# EAGLE design decoder (EAGLE 7.2.0)
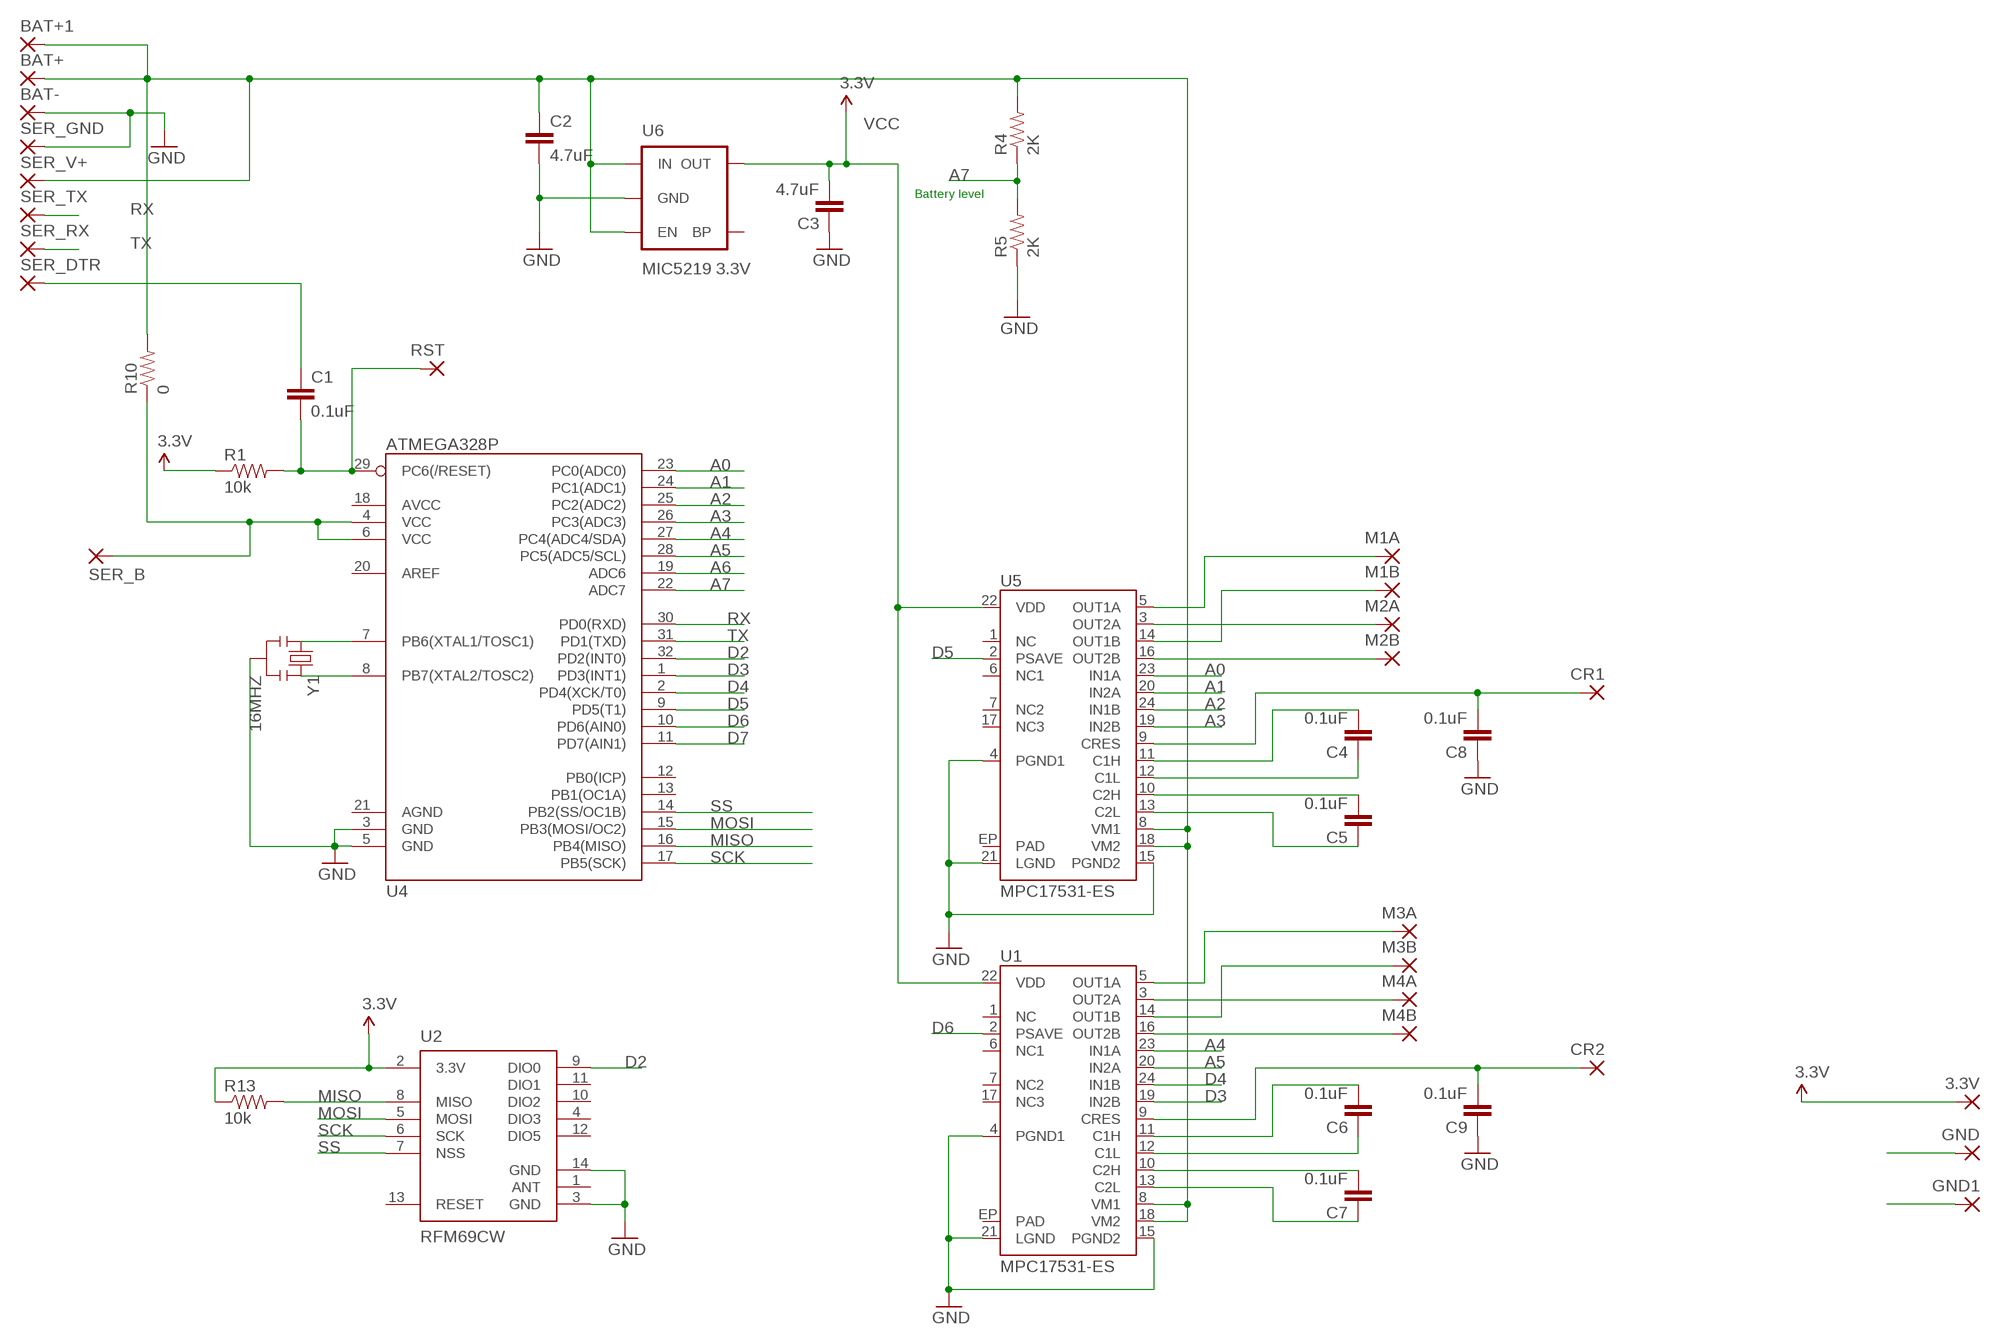
[diagram p0: schematic, sheet 1]

## Parts
3.3V  SMD2  [SMD1,27-2,54]
BAT+  SMD2  [SMD1,27-2,54]
BAT+1  SMD2  [SMD1,27-2,54]
BAT-  SMD2  [SMD1,27-2,54]
C1  0.1uF  CAP0805  [0805]
C2  4.7uF  CAP0805  [0805]
C3  4.7uF  CAP0805  [0805]
C4  0.1uF  CAP0805  [0805]
C5  0.1uF  CAP0805  [0805]
C6  0.1uF  CAP0805  [0805]
C7  0.1uF  CAP0805  [0805]
C8  0.1uF  CAP0805  [0805]
C9  0.1uF  CAP0805  [0805]
CR1  SMD2  [SMD1,27-2,54]
CR2  SMD2  [SMD1,27-2,54]
GND  SMD2  [SMD1,27-2,54]
GND1  SMD2  [SMD1,27-2,54]
M1A  SMD2  [SMD1,27-2,54]
M1B  SMD2  [SMD1,27-2,54]
M2A  SMD2  [SMD1,27-2,54]
M2B  SMD2  [SMD1,27-2,54]
M3A  SMD2  [SMD1,27-2,54]
M3B  SMD2  [SMD1,27-2,54]
M4A  SMD2  [SMD1,27-2,54]
M4B  SMD2  [SMD1,27-2,54]
R1  10k  RESISTOR0603-RES  [0603-RES]
R4  2K  RESISTOR0603-RES  [0603-RES]
R5  2K  RESISTOR0603-RES  [0603-RES]
R10  0  RESISTOR0603-RES  [0603-RES]
R13  10k  RESISTOR0603-RES  [0603-RES]
RST  SMD2  [SMD1,27-2,54]
SER_B  SMD2  [SMD1,27-2,54]
SER_DTR  SMD2  [SMD1,27-2,54]
SER_GND  SMD2  [SMD1,27-2,54]
SER_RX  SMD2  [SMD1,27-2,54]
SER_TX  SMD2  [SMD1,27-2,54]
SER_V+  SMD2  [SMD1,27-2,54]
U1  MPC17531-ES  [QFN-24_ALT2]
U2  RFM69CW  [RFM69CW-XXXS2]
U4  ATMEGA328P  ATMEGA328_SMT  [TQFP32-08]
U5  MPC17531-ES  [QFN-24_ALT2]
U6  MIC5219 3.3V  V_REG_MIC52193.3V  [SOT23-5]
Y1  16MHZ  RESONATOR16MHZ  [RESONATOR-SMD]

## Nets
A0: U4.23(PC0(ADC0)) U5.23(IN1A)
A1: U4.24(PC1(ADC1)) U5.20(IN2A)
A2: U4.25(PC2(ADC2)) U5.24(IN1B)
A3: U4.26(PC3(ADC3)) U5.19(IN2B)
A4: U1.23(IN1A) U4.27(PC4(ADC4/SDA))
A5: U1.20(IN2A) U4.28(PC5(ADC5/SCL))
A6: U4.19(ADC6)
A7: R4.1 R5.2 U4.22(ADC7)
BAT+: BAT+1.1(P) BAT+.1(P) C2.1 R4.2 R10.2 SER_V+.1(P) U1.8(VM1) U1.18(VM2) U5.8(VM1) U5.18(VM2) U6.1(IN) U6.3(EN)
D2: U2.9(DIO0) U4.32(PD2(INT0))
D3: U1.19(IN2B) U4.1(PD3(INT1))
D4: U1.24(IN1B) U4.2(PD4(XCK/T0))
D5: U4.9(PD5(T1)) U5.2(PSAVE)
D6: U1.2(PSAVE) U4.10(PD6(AIN0))
D7: U4.11(PD7(AIN1))
GND: BAT-.1(P) C2.2 C3.1 C8.1 C9.1 GND1.1(P) GND.1(P) R5.1 SER_GND.1(P) U1.4(PGND1) U1.15(PGND2) U1.21(LGND) U2.3(GND) U2.14(GND) U4.3(GND) U4.5(GND) U5.4(PGND1) U5.15(PGND2) U5.21(LGND) U6.2(GND) Y1.2
MISO: R13.2 U2.8(MISO) U4.16(PB4(MISO))
MOSI: U2.5(MOSI) U4.15(PB3(MOSI/OC2))
N$1: C4.2 U5.11(C1H)
N$2: U4.7(PB6(XTAL1/TOSC1)) Y1.1
N$3: C1.1 SER_DTR.1(P)
N$4: U4.8(PB7(XTAL2/TOSC2)) Y1.3
N$5: C1.2 R1.2 RST.1(P) U4.29(PC6(/RESET))
N$6: C4.1 U5.12(C1L)
N$7: C5.2 U5.10(C2H)
N$8: R10.1 SER_B.1(P) U4.4(VCC) U4.6(VCC)
N$10: M1A.1(P) U5.5(OUT1A)
N$12: C5.1 U5.13(C2L)
N$13: C6.2 U1.11(C1H)
N$14: M2A.1(P) U5.3(OUT2A)
N$15: M1B.1(P) U5.14(OUT1B)
N$16: C6.1 U1.12(C1L)
N$17: M2B.1(P) U5.16(OUT2B)
N$18: C7.2 U1.10(C2H)
N$19: C7.1 U1.13(C2L)
N$20: C8.2 CR1.1(P) U5.9(CRES)
N$21: C9.2 CR2.1(P) U1.9(CRES)
N$29: M3A.1(P) U1.5(OUT1A)
N$30: M3B.1(P) U1.14(OUT1B)
N$31: M4A.1(P) U1.3(OUT2A)
N$32: M4B.1(P) U1.16(OUT2B)
RX: SER_TX.1(P) U4.30(PD0(RXD))
SCK: U2.6(SCK) U4.17(PB5(SCK))
SS: U2.7(NSS) U4.14(PB2(SS/OC1B))
TX: SER_RX.1(P) U4.31(PD1(TXD))
VCC: 3.3V.1(P) C3.2 R1.1 R13.1 U1.22(VDD) U2.2(3.3V) U5.22(VDD) U6.5(OUT) ; supply symbol labelled 3.3V
Unconnected: U1.1(NC) U1.6(NC1) U1.7(NC2) U1.17(NC3) U1.EP(PAD) U2.1(ANT) U2.4(DIO3) U2.10(DIO2) U2.11(DIO1) U2.12(DIO5) U2.13(RESET) U4.12(PB0(ICP)) U4.13(PB1(OC1A)) U4.18(AVCC) U4.20(AREF) U4.21(AGND) U5.1(NC) U5.6(NC1) U5.7(NC2) U5.17(NC3) U5.EP(PAD) U6.4(BP)

## Notes on the sheet
- Battery level

## Library data of the parts
3.3V BAT+ BAT+1 BAT- CR1 CR2 GND GND1 M1A M1B M2A M2B M3A M3B M4A M4B RST SER_B SER_DTR SER_GND SER_RX SER_TX SER_V+ = wirepad:SMD2: SMD PAD
C1-C9 = SparkFun-Capacitors:CAP: Capacitor Standard 0603 ceramic capacitor, and 0.1" leaded capacitor.
R1 R4 R5 R10 R13 = SparkFun-Resistors:RESISTOR: Resistor Basic schematic elements and footprints for 0603, 1206, and PTH resistors.
U1 U5 = Arduino_merg:MPC17531: Dual Bridge Packages: TSSOP-24, 24-pin QFN Last modified: 8/20/10 Unproven!
U2 = SparkFun-RF:RFM69
U4 = SparkFun-DigitalIC:ATMEGA328_SMT: 32-Pin Atmega328 part Commonly used on Arduino compatible boards Available in QFP and QFN packages TQFP is IC-09069 QFN is non-stock; PROD_ID: IC-09069
U6 = SparkFun-PowerIC:V_REG_MIC5219: V_REG MIC5219 Standard 3.3V and 5V 500mA LDO voltage regulator in SOT-23 layout. Micrel part MIC5219. BP (by-pass) pin is used to lower output noise with 470pF cap, may be left open.; PROD_ID: VREG-09872
Y1 = SparkFun-FreqCtrl:RESONATOR: Resonator Small SMD resonator. Used, eg, on the Arduino Pro/ Pro Mini boards. 8MHz- XTAL-08895 16MHz- XTAL-08900; PROD_ID: XTAL-08900

## Board
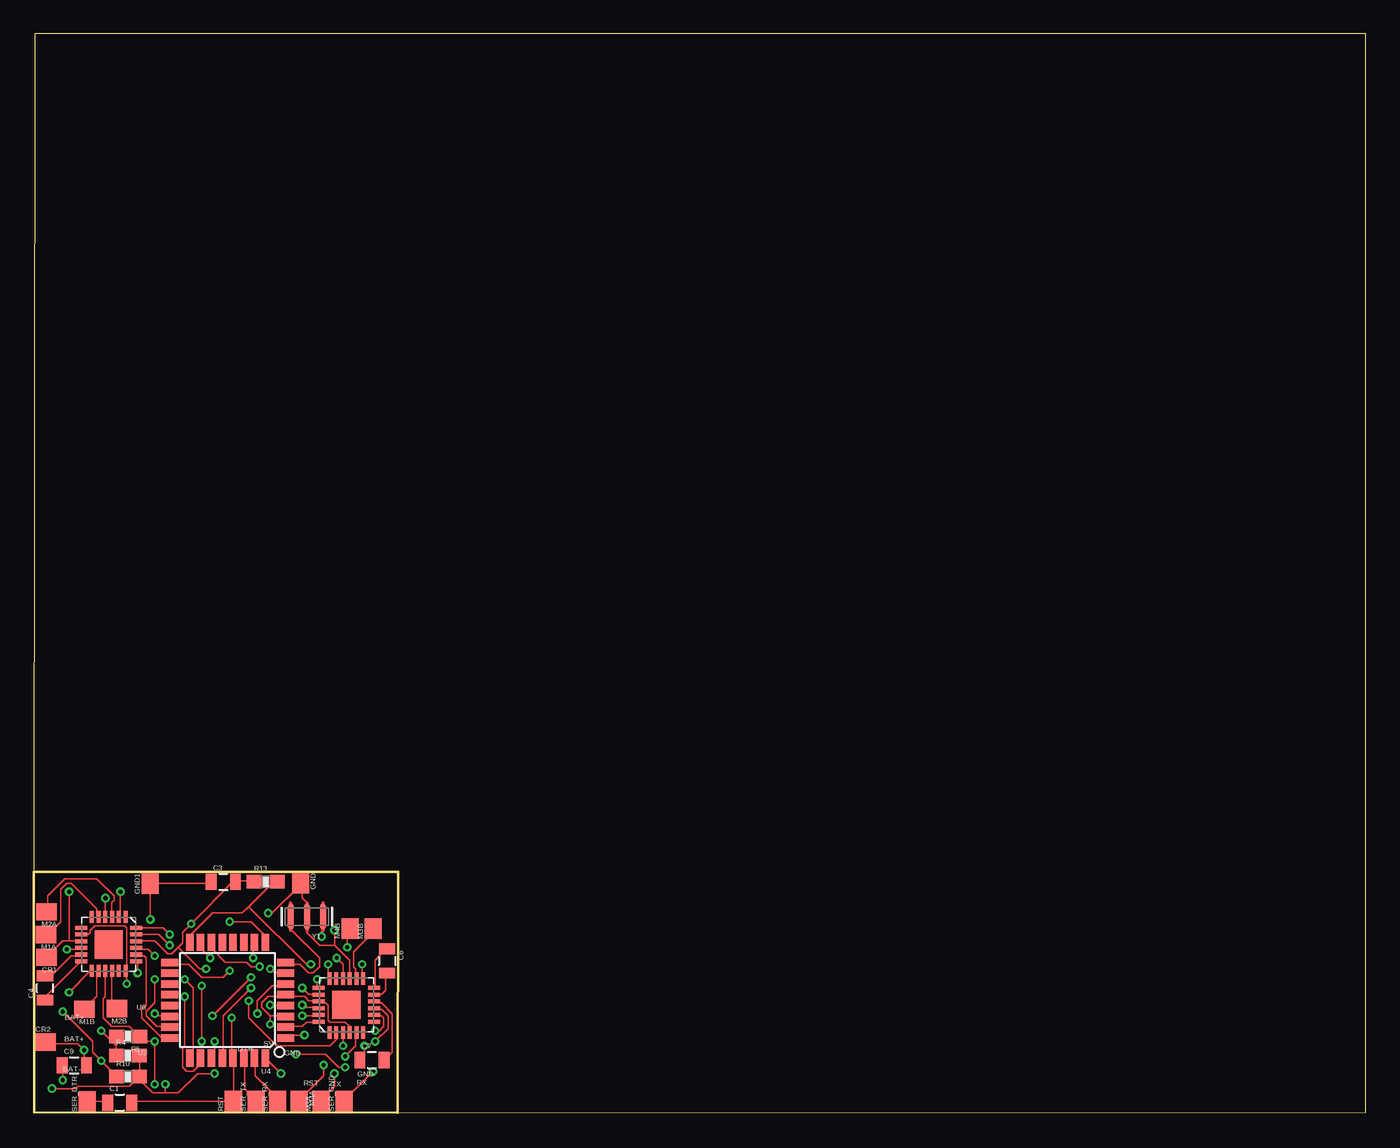
[diagram p1: board, top side]
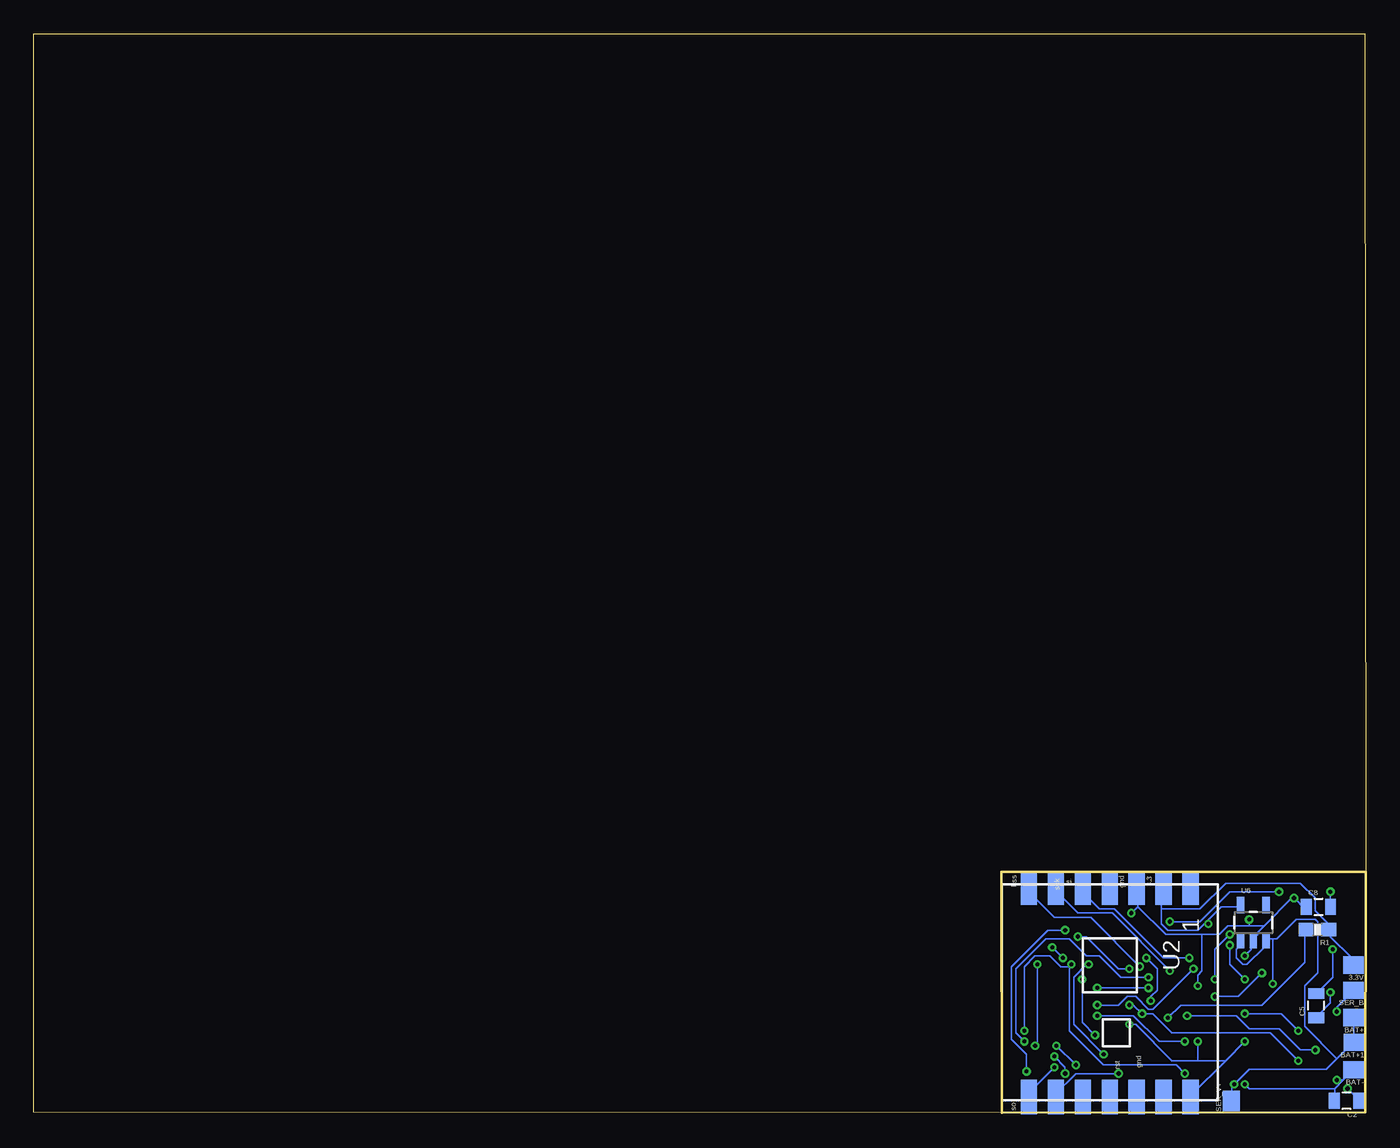
[diagram p2: board, bottom side, seen from below]

Size 98.81 x 80.04 mm. Coordinates in mm from the lower left corner, seen from the top.
Outline: 27.01,0 98.81,0.04 98.81,80.04 0.08,80.04 0,17.87
Outline: 0,17.87 27.03,17.88 27.01,0
Outline: 27.01,0 0.02,0.02 0,17.87
Copper layers (1*16): Top 0.035mm / dielectric 1.5mm / Bottom 0.035mm
Design rules "Elecrow_2-layer_eagle_rule *": minimum track width 5mil, minimum drill 12mil, track to track 6mil, track to pad 6mil, pad to pad 6mil, via to via 6mil, smd to smd 0mil, copper to edge 10mil, drill to drill 10mil, minimum pad ring 10mil, minimum via ring 6mil, stop-mask expansion 2mil, vias tented up to drill 100mil, thermal gap 10mil

### Footprints (pad centres in the part's own frame; a part is rotated, then mirrored left to right if it is on the bottom)
SMD1,27-2,54 = smd 1.27 x 1.524: 1 0,0
0805 = smd 0.8 x 1.2: 1 -0.9,0; 2 0.9,0
0603-RES = smd 1.1 x 1: 1 -0.85,0; 2 0.85,0
QFN-24_ALT2 = smd 0.9 x 0.3: 1 -2.05,1.25; 2 -2.05,0.75; 3 -2.05,0.25; 4 -2.05,-0.25; 5 -2.05,-0.75; 6 -2.05,-1.25; 13 1.95,-1.25; 14 1.95,-0.75; 15 1.95,-0.25; 16 1.95,0.25; 17 1.95,0.75; 18 1.95,1.25 | smd 0.3 x 0.9: 7 -1.25,-2.05; 8 -0.75,-2.05; 9 -0.25,-2.05; 10 0.25,-2.05; 11 0.75,-2.05; 12 1.25,-2.05; 19 1.25,2.05; 20 0.75,2.05; 21 0.25,2.05; 22 -0.25,2.05; 23 -0.75,2.05; 24 -1.25,2.05 | smd 2.1 x 2.1: EP 0,0
RFM69CW-XXXS2 = smd 2.543 x 1.2: 1 -7.754,6; 2 -7.754,4; 3 -7.754,2; 4 -7.754,0; 5 -7.754,-2; 6 -7.754,-4; 7 -7.754,-6; 8 7.754,-6; 9 7.754,-4; 10 7.754,-2; 11 7.754,0; 12 7.754,2; 13 7.754,4; 14 7.754,6
TQFP32-08 = smd 1.27 x 0.559: 1 -4.293,2.8; 2 -4.293,2; 3 -4.293,1.2; 4 -4.293,0.4; 5 -4.293,-0.4; 6 -4.293,-1.2; 7 -4.293,-2; 8 -4.293,-2.8; 17 4.293,-2.8; 18 4.293,-2; 19 4.293,-1.2; 20 4.293,-0.4; 21 4.293,0.4; 22 4.293,1.2; 23 4.293,2; 24 4.293,2.8 | smd 0.559 x 1.27: 9 -2.8,-4.293; 10 -2,-4.293; 11 -1.2,-4.293; 12 -0.4,-4.293; 13 0.4,-4.293; 14 1.2,-4.293; 15 2,-4.293; 16 2.8,-4.293; 25 2.8,4.293; 26 2,4.293; 27 1.2,4.293; 28 0.4,4.293; 29 -0.4,4.293; 30 -1.2,4.293; 31 -2,4.293; 32 -2.8,4.293
SOT23-5 = smd 0.55 x 1.2: 1 -0.95,-1.3; 2 0,-1.3; 3 0.95,-1.3; 4 0.95,1.3; 5 -0.95,1.3
RESONATOR-SMD = smd 0.45 x 1.905: 1 -1.2,0; 2 0,0; 3 1.2,0

### Placement (x,y rotation side)
3.3V  0.92,10.95 90 bottom
BAT+  0.89,7.06 90 bottom
BAT+1  0.88,5.21 90 bottom
BAT-  0.9,3.19 90 bottom
C1  6.38,0.75 0 top
C2  1.44,0.88 180 bottom
C3  14.06,17.12 0 top
C4  0.83,9.26 90 top
C5  3.68,7.94 90 bottom
C6  26.22,11.26 270 top
C7  25.1,3.9 0 top
C8  3.51,15.27 0 bottom
C9  3.01,3.5 0 top
CR1  0.94,11.52 90 top
CR2  0.88,5.24 270 top
GND  19.8,17.01 180 top
GND1  8.63,16.99 0 top
M1A  0.9,13.21 90 top
M1B  3.78,7.68 90 top
M2A  0.95,14.91 90 top
M2B  6.17,7.72 90 top
M3A  21.33,0.85 0 top
M3B  25.18,13.64 0 top
M4A  19.7,0.87 180 top
M4B  23.47,13.65 0 top
R1  3.59,13.58 180 bottom
R4  6.98,4.23 0 top
R5  7.01,5.66 180 top
R10  6.99,2.67 0 top
R13  17.21,17.13 0 top
RST  14.82,0.85 0 top
SER_B  0.9,9.09 90 bottom
SER_DTR  3.97,0.84 0 top
SER_GND  23.03,0.86 0 top
SER_RX  18.11,0.85 0 top
SER_TX  16.49,0.85 0 top
SER_V+  9.96,0.85 0 bottom
U1  23.2,8 90 top
U2  19,8.92 270 bottom
U4  14.38,8.34 180 top
U5  5.57,12.48 270 top
U6  8.34,14.1 0 bottom
Y1  20.27,14.54 180 top

### Tracks (layer width: path | path; a pad name or v marks a point on that pad's centre or on a via)
A0  (via drill 0.3)
  Top 0.127: v10.08,12.43 9.29,13.22 7.7,13.22 U5.23 | v8.97,9.88 8.97,8.14 8.34,7.5 8.34,7.19 9.13,6.39 10.08,6.39 U4.23
  Bottom 0.127: v10.08,12.43 10.08,11 v8.97,9.88
A1
  Top 0.127: U5.20 7.7,11.63 8.18,11.63 8.34,11.47 8.34,7.98 8.02,7.66 8.02,7.03 9.45,5.6 10.08,5.6 U4.24
A2  (via drill 0.3)
  Top 0.127: v10.08,13.22 9.61,13.69 7.7,13.69 U5.24 | v11.2,9.88 11.83,9.25 11.83,4.33 11.67,4.17 U4.25
  Bottom 0.127: v10.08,13.22 11.2,12.11 v11.2,9.88
A3  (via drill 0.3)
  Top 0.127: v7.7,10.36 7.7,11.16 U5.19 | v11.2,8.61 11.2,4.96 11.04,4.81 11.04,3.38 11.35,3.06 11.83,3.06 12.31,3.54 12.31,4.01 U4.26
  Bottom 0.127: v7.7,10.36 9.45,8.61 v11.2,8.61
A4  (via drill 0.3)
  Top 0.127: v19.93,7.19 21.04,7.19 U1.23 | v13.42,5.28 13.42,4.33 13.26,4.17 U4.27
  Bottom 0.127: v19.93,7.19 17.23,7.19 15.32,5.28 v13.42,5.28
A5  (via drill 0.3)
  Top 0.127: v19.93,9.25 20.4,8.77 21.04,8.77 U1.20 | v16.12,9.25 14.05,7.19 14.05,4.17 U4.28
  Bottom 0.127: v16.12,9.25 v19.93,9.25
A7  (via drill 0.3)
  Top 0.127: 6.12,4.96 6.12,5.6 R5.2 | 6.12,4.96 6.12,4.33 R4.1 | v8.97,7.35 9.13,7.19 10.08,7.19 U4.22 | 6.12,4.96 v5,6.07
  Bottom 0.127: v8.97,7.35 6.27,7.35 v5,6.07
BAT+  (via drill 0.3)
  Top 0.127: U5.8 3.58,13.22 4.05,13.22 4.21,13.38 4.21,13.54 4.53,13.85 6.75,13.85 6.91,13.69 6.91,10.68 U5.18 6.91,10.52 v6.91,9.57 | v25.32,6.07 25.64,6.07 25.96,6.39 25.96,7.03 25.8,7.19 25.32,7.19 U1.8 | v21.83,11 21.83,10.04 U1.18 | R4.2 7.86,4.17 7.86,2.74 R10.2 7.7,2.58 | v1.35,1.79 3.1,1.79 3.26,1.95 7.07,1.95 7.7,2.58 | v13.42,2.9 12.15,2.9 10.72,1.47 9.77,1.47 | 9.77,1.47 8.81,1.47 7.7,2.58 | 9.77,1.47 v9.77,2.11
  Bottom 0.127: U6.1 9.45,12.74 9.45,12.27 9.61,12.11 9.61,11.47 9.13,11 8.81,11 7.54,12.27 7.54,12.74 U6.3 7.38,12.9 6.91,12.9 | BAT+.1 0.88,7.03 0.88,5.28 BAT+1.1 1.04,5.12 2.15,4.01 | 2.15,4.01 2.94,3.22 8.65,3.22 v9.77,2.11 9.93,1.95 9.93,1 SER_V+.1 | 6.91,12.9 6.59,12.9 5.16,14.33 3.73,14.33 3.58,14.17 3.58,10.36 4.53,9.41 4.53,6.39 2.15,4.01 | 6.91,12.9 v6.91,9.57 | v25.32,6.07 25.32,10.84 24.53,11.63 23.42,11.63 22.62,10.84 21.99,10.84 | v1.35,1.79 0.56,1 C2.1 | 21.99,10.84 21.99,6.07 19.45,3.54 14.05,3.54 v13.42,2.9 | 21.99,10.84 v21.83,11
D2  (via drill 0.3)
  Top 0.127: v18.34,2.9 17.23,4.01 U4.32
  Bottom 0.127: v18.34,2.9 21.51,2.9 23.1,1.31 U2.9
D3  (via drill 0.3)
  Top 0.127: v21.04,9.88 21.04,9.25 U1.19 | v20.09,5.76 18.97,5.76 18.82,5.6 U4.1
  Bottom 0.127: v21.04,9.88 21.04,6.71 v20.09,5.76
D4
  Top 0.127: U1.24 21.04,6.71 20.24,6.71 19.93,6.39 18.82,6.39 U4.2
D5  (via drill 0.3)
  Top 0.127: v6.43,16.39 6.43,14.65 U5.2 | v14.53,14.17 16.12,14.17 17.07,13.22 17.07,12.74 U4.9
  Bottom 0.127: v6.43,16.39 10.08,16.39 12.31,14.17 v14.53,14.17
D6  (via drill 0.3)
  Top 0.127: v15.96,8.3 15.96,7.03 18.02,4.96 21.99,4.96 22.47,5.44 22.47,5.92 U1.2 | v16.27,11.47 16.27,12.58 U4.10
  Bottom 0.127: v15.96,8.3 15.96,8.61 15.48,9.09 15.48,10.68 v16.27,11.47
GND  (via drill 0.3)
  Top 0.127: U1.4 23.42,6.07 23.42,6.39 23.1,6.71 21.99,6.71 21.83,6.87 21.83,7.98 21.67,8.14 21.2,8.14 U1.21 21.04,8.3 20.4,8.3 20.09,8.61 18.82,8.61 U4.5 18.66,8.61 17.39,8.61 16.91,8.14 16.91,7.82 17.55,7.19 | 17.55,7.19 18.66,7.19 U4.3 | v2.15,2.42 2.15,3.38 C9.1 | U5.15 5.32,8.61 5.16,8.46 5.16,7.03 5.8,6.39 7.07,6.39 7.7,5.76 R5.1 7.86,5.6 8.18,5.28 v8.97,5.28 v8.97,2.11 | v17.55,6.55 17.55,7.19 | C3.1 13.1,17.03 8.65,17.03 GND1.1 8.65,16.87 v8.65,14.33 | v8.97,11.63 8.5,12.11 7.7,12.11 U5.21 | v5.32,15.92 5.32,14.65 U5.4 | 22.31,12.43 23.42,11.31 23.42,10.04 U1.15 | 22.31,12.43 21.2,12.43 20.24,13.38 20.24,13.54 20.27,13.53 | Y1.2 20.24,15.6 19.93,15.92 19.93,16.87 GND.1 19.77,16.87 17.7,14.81 v17.39,14.81 | v25.16,3.06 23.1,1 SER_GND.1 | 22.31,12.43 v22.31,13.54 | v12.46,9.41 v12.46,5.28
  Bottom 0.127: 2.31,1.79 2.31,1 C2.2 | 1.67,2.42 1.04,3.06 BAT-.1 | 1.67,2.42 2.31,1.79 | 1.67,2.42 v2.15,2.42 | v8.97,5.28 10.4,3.85 | 10.4,3.85 12.94,1.31 U2.14 | 2.31,1.79 8.65,1.79 v8.97,2.11 | v17.55,6.55 17.07,6.55 14.37,3.85 12.46,3.85 | 10.4,3.85 12.46,3.85 | v8.97,11.63 8.5,12.11 8.5,12.74 U6.2 8.34,12.9 8.02,13.22 8.02,13.38 7.54,13.85 | C8.1 4.53,15.12 v5.32,15.92 5.48,15.92 7.54,13.85 | 16.91,15.28 16.91,16.55 U2.3 | 16.91,15.28 14.85,13.22 12.15,13.22 | 12.15,13.22 10.88,13.22 10.24,13.85 8.65,13.85 | 7.54,13.85 8.65,13.85 | 8.65,13.85 v8.65,14.33 | v25.16,3.06 25.16,4.33 26.28,5.44 26.28,10.84 23.58,13.54 v22.31,13.54 | v17.39,14.81 16.91,15.28 | v12.46,5.28 12.46,3.85 | v12.46,9.41 12.46,10.2 12.15,10.52 12.15,13.22
MISO  (via drill 0.3)
  Top 0.127: 15.96,15.28 15.48,14.81 13.26,14.81 11.67,13.22 11.67,12.74 U4.16 | 15.96,15.28 17.7,17.03 18.02,17.03 R13.2 | v23.1,3.38 22.62,3.38 21.67,4.33 v19.45,4.33 | v20.56,11 20.24,11 15.96,15.28
  Bottom 0.127: v23.1,3.38 24.85,1.63 24.85,1.31 U2.8 | v19.45,4.33 21.67,6.55 21.67,10.04 20.72,11 v20.56,11
MOSI  (via drill 0.3)
  Top 0.127: v13.1,11.47 12.46,12.11 12.46,12.58 U4.15
  Bottom 0.127: v13.1,11.47 15,11.47 18.66,15.12 19.77,15.12 20.88,16.23 20.88,16.55 U2.5
N$1
  Top 0.127: U5.11 3.42,11.63 2.78,11.63 1.35,10.2 0.88,10.2 C4.2
N$2  (via drill 0.3)
  Top 0.127: v17.55,10.68 17.86,10.36 18.66,10.36 U4.7 | v21.36,13.06 21.36,13.54 21.47,13.53
  Bottom 0.127: v17.55,10.68 18.34,10.68 20.72,13.06 v21.36,13.06
N$3
  Top 0.127: C1.1 5.32,0.84 4.05,0.84 SER_DTR.1
N$4
  Top 0.127: U4.8 18.82,11 19.77,11 20.4,10.36 20.72,10.36 21.2,10.84 21.2,11.47 19.13,13.54 19.07,13.53
N$5  (via drill 0.3)
  Top 0.127: C1.2 7.38,0.84 14.69,0.84 RST.1 14.85,1 14.85,4.01 U4.29 14.69,4.17 v14.69,7.03
  Bottom 0.127: v14.69,7.03 13.73,7.98 7.7,7.98 4.53,11.16 4.53,13.54 R1.2
N$6
  Top 0.127: U5.12 3.42,11.16 0.72,8.46 C4.1
N$7  (via drill 0.3)
  Top 0.127: v2.46,12.11 3.42,12.11 U5.10
  Bottom 0.127: v2.46,12.11 2.46,10.04 3.58,8.93 C5.2
N$8  (via drill 0.3)
  Top 0.127: v17.55,7.98 18.66,7.98 U4.4 | v16.59,7.35 16.59,8.3 17.7,9.41 18.66,9.41 U4.6 | v2.15,7.5 4.37,5.28 4.37,4.49 v5,3.85 6.12,2.74 R10.1
  Bottom 0.127: v17.55,7.98 17.23,7.98 v16.59,7.35 15.8,7.35 14.37,5.92 7.07,5.92 v5,3.85 | v2.15,7.5 2.15,7.82 1.04,8.93 SER_B.1
N$10
  Top 0.127: U5.5 4.69,14.65 4.69,15.12 2.78,17.03 2.46,17.03 1.99,16.55 1.99,14.17 1.04,13.22 M1A.1
N$12  (via drill 0.3)
  Top 0.127: v2.62,8.93 4.21,10.52 U5.13
  Bottom 0.127: v2.62,8.93 2.62,8.14 3.58,7.19 C5.1
N$13
  Top 0.127: U1.11 25.32,8.77 25.8,8.77 26.12,9.09 26.12,10.2 C6.2
N$14
  Top 0.127: U5.3 5.8,14.65 5.8,15.6 5.96,15.76 5.96,16.08 4.69,17.35 2.31,17.35 1.04,16.08 1.04,14.96 M2A.1
N$15
  Top 0.127: U5.14 4.69,10.52 4.69,8.61 3.89,7.82 M1B.1
N$16
  Top 0.127: U1.12 25.32,9.25 25.32,11.31 26.12,12.11 C6.1
N$17
  Top 0.127: U5.16 5.8,10.52 5.8,8.14 6.12,7.82 M2B.1
N$18
  Top 0.127: U1.10 25.32,8.14 25.8,8.14 26.59,7.35 26.59,4.49 26.12,4.01 C7.2
N$19  (via drill 0.3)
  Top 0.127: v24.37,11 24.37,10.04 U1.13 | v24.53,4.96 24.53,4.33 24.21,4.01 C7.1
  Bottom 0.127: v24.37,11 24.37,5.12 v24.53,4.96
N$20  (via drill 0.3)
  Top 0.127: 2.62,12.74 2.15,12.74 1.04,11.63 CR1.1 | 2.62,12.74 3.42,12.74 U5.9 | 2.62,12.74 v2.62,16.39
  Bottom 0.127: v2.62,16.39 C8.2
N$21  (via drill 0.3)
  Top 0.127: v25.32,5.28 26.28,6.23 26.28,7.19 25.8,7.66 25.32,7.66 U1.9 | v13.26,7.19 v16.12,10.04 | C9.2 3.89,3.54 3.73,3.69 v3.73,4.65 3.26,5.12 1.04,5.12 CR2.1
  Bottom 0.127: v25.32,5.28 25.96,5.92 25.96,10.68 23.74,12.9 21.99,12.9 20.72,11.63 19.77,11.63 18.18,10.04 v16.12,10.04 | v13.26,7.19 9.61,7.19 8.65,6.23 6.43,6.23 4.84,4.65 v3.73,4.65
N$29  (via drill 0.3)
  Top 0.127: v23.1,4.17 23.89,4.96 23.89,5.92 U1.5 | v22.31,2.9 22.31,1.95 21.36,1 M3A.1
  Bottom 0.127: v23.1,4.17 22.31,3.38 v22.31,2.9
N$30
  Top 0.127: U1.14 23.89,10.04 23.89,10.68 23.74,10.84 23.74,11.95 25.32,13.54 M3B.1
N$31  (via drill 0.3)
  Top 0.127: v22.94,4.96 22.94,5.92 U1.3 | v21.51,3.54 21.51,2.74 19.77,1 M4A.1
  Bottom 0.127: v21.51,3.54 v22.94,4.96
N$32  (via drill 0.3)
  Top 0.127: v22.47,11.47 22.94,11 22.94,10.04 U1.16 | v23.26,12.27 23.26,13.38 23.42,13.54 M4B.1
  Bottom 0.127: v23.26,12.27 v22.47,11.47
RX
  Top 0.127: U4.30 15.64,4.01 15.64,1.79 16.43,1 SER_TX.1
SCK  (via drill 0.3)
  Top 0.127: v14.53,10.52 14.05,10.04 12.46,10.04 11.51,11 10.24,11 U4.17
  Bottom 0.127: v14.53,10.52 18.82,14.81 21.36,14.81 23.1,16.55 U2.6
SS  (via drill 0.3)
  Top 0.127: v16.75,10.84 16.12,10.84 15.8,11.16 14.21,11.16 13.26,12.11 13.26,12.58 U4.14
  Bottom 0.127: v16.75,10.84 20.4,14.49 23.1,14.49 24.85,16.23 24.85,16.55 U2.7
TX
  Top 0.127: U4.31 16.43,4.01 16.43,2.74 18.18,1 SER_RX.1
VCC  (via drill 0.3)
  Top 0.127: 10.72,12.27 11.04,12.58 11.04,13.38 v11.67,14.01 14.85,17.19 C3.2 15,17.19 16.27,17.19 R13.1 | 10.72,12.27 10.24,11.79 9.93,11.79 8.97,12.74 7.7,12.74 U5.22 | v19.93,7.98 20.09,7.82 21.04,7.82 U1.22 | v12.78,10.68 12.31,10.68 10.72,12.27
  Bottom 0.127: v19.93,7.98 18.34,7.98 17.7,8.61 17.07,8.61 16.12,7.66 15.8,7.66 v12.78,10.68 | 3.3V.1 1.04,11 1.04,11.47 2.62,13.06 2.62,13.54 R1.1 2.78,13.69 2.78,14.01 3.73,14.96 3.73,15.92 4.84,17.03 10.4,17.03 12.31,15.12 15.16,15.12 | 11.83,14.17 12.46,13.54 14.69,13.54 15.16,14.01 15.16,15.12 | 11.83,14.17 10.72,15.28 9.45,15.28 U6.5 | 15.16,15.12 15.16,16.39 15,16.55 U2.2 | 11.83,14.17 v11.67,14.01

### Text on the board
_tsilk: U6 | BAT+ | BAT+ | SV+ | U3 | DTR | GND | BAT- | GND | RST | TX | RX
_bsilk: 3.3 | gnd | si | hss | sck | gnd | rst | so